# EAGLE schematic Open Flight Controller (EAGLE 9.0.0)

## Sheet 1 of 2
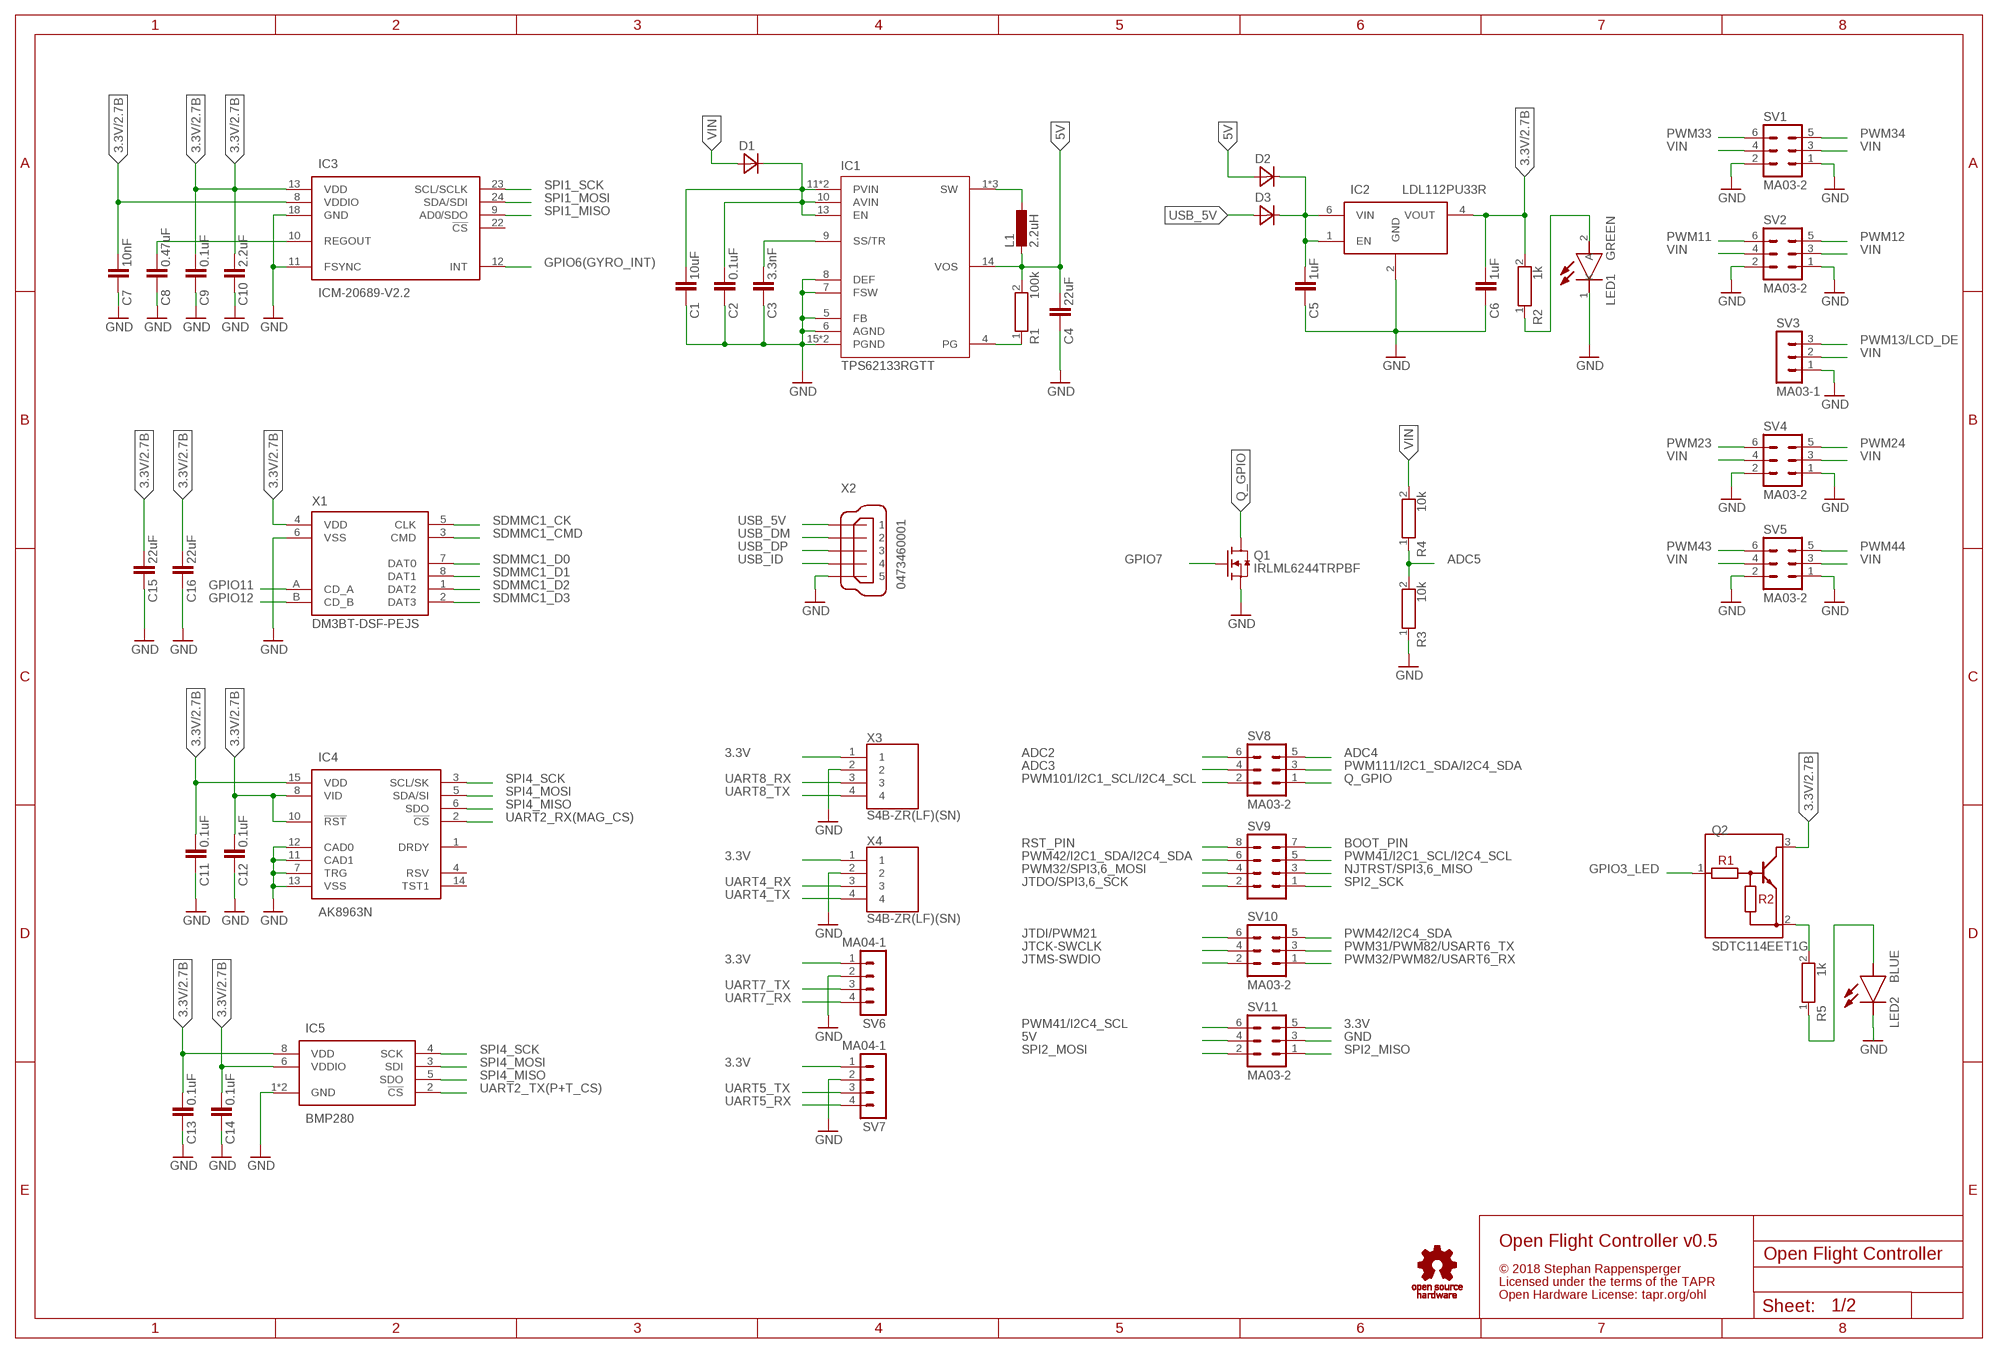
[diagram p0: schematic, sheet 1]

### Parts
C1  10uF  GRM188R61E106MA73D  [CAPC1608X90N]
C2  0.1uF  GRM188R71H104KA93D  [CAPC1608X90N]
C3  3.3nF  GRM188R71H332KA01D  [CAPC1608X90N]
C4  22uF  CL10A226KQ8NRNE  [CAPC1608X100N]
C5  1uF  GRM188R71C105KA12D  [CAPC1608X90N]
C6  1uF  GRM188R71C105KA12D  [CAPC1608X90N]
C7  10nF  GRM1885C1E103JA01D  [CAPC1608X90N]
C8  0.47uF  GRM188R71E474KA12D  [CAPC1608X90N]
C9  0.1uF  GRM188R71H104KA93D  [CAPC1608X90N]
C10  2.2uF  GRM188R71A225KE15D  [CAPC1608X90N]
C11  0.1uF  GRM188R71H104KA93D  [CAPC1608X90N]
C12  0.1uF  GRM188R71H104KA93D  [CAPC1608X90N]
C13  0.1uF  GRM188R71H104KA93D  [CAPC1608X90N]
C14  0.1uF  GRM188R71H104KA93D  [CAPC1608X90N]
C15  22uF  CL10A226KQ8NRNE  [CAPC1608X100N]
C16  22uF  CL10A226KQ8NRNE  [CAPC1608X100N]
D1  RBR3MM40ATR  [PMDU]
D2  RBR3MM40ATR  [PMDU]
D3  RBR3MM40ATR  [PMDU]
IC1  TPS62133RGTT  [RGT16_1P7X1P7]
IC2  LDL112PU33R  [SON50P200X200X80-7N]
IC3  ICM-20689-V2.2  [QFN50P400X400X95-25N]
IC4  AK8963N  [QFN50P300X300X80-17N]
IC5  BMP280  [8-PIN-METAL-LID-LGA]
L1  2.2uH  DFE252012P-2R2M=P2  [INDC2520X120N]
LED1  GREEN  VLMG1300-GS08  [LEDC1608X100N]
LED2  BLUE  VLMB1300-GS08  [LEDC1608X100N]
Q1  IRLML6244TRPBF  [SOT95P237X112-3N]
Q2  SDTC114EET1G  [SOT50P160X90-3N]
R1  100k  CRCW0603100KFKEA  [RESC1608X50N]
R2  1k  CRCW06031K00FKEA  [RESC1608X50N]
R3  10k  CRCW060310K0FKEA  [RESC1608X50N]
R4  10k  CRCW060310K0FKEA  [RESC1608X50N]
R5  1k  CRCW06031K00FKEA  [RESC1608X50N]
SV1  MA03-2  [MA03-2]
SV2  MA03-2  [MA03-2]
SV3  MA03-1  [MA03-1]
SV4  MA03-2  [MA03-2]
SV5  MA03-2  [MA03-2]
SV6  MA04-1  [MA04-1]
SV7  MA04-1  [MA04-1]
SV8  MA03-2  [MA03-2]
SV9  MA04-2  [MA04-2]
SV10  MA03-2  [MA03-2]
SV11  MA03-2  [MA03-2]
X1  DM3BT-DSF-PEJS  [DM3BT-DSF-PEJS]
X2  0473460001  [0473460001]
X3  S4B-ZR(LF)(SN)  [SHDR4W50P0X150_1X4_750X600X370]
X4  S4B-ZR(LF)(SN)  [SHDR4W50P0X150_1X4_750X600X370]

### Nets
3.3V: C6.1 C7.1 C9.1 C10.1 C11.1 C12.1 C13.1 C14.1 C15.1 C16.1 IC2.4(VOUT) IC3.8(VDDIO) IC3.13(VDD) IC4.8(VID) IC4.10(!RST) IC4.15(VDD) IC5.6(VDDIO) IC5.8(VDD) Q2.3(C) R2.2 SV6.1 SV7.1 SV11.5 X1.4(VDD) X3.1 X4.1 ; also sheet 2
5V: C4.1 D2.1(A) IC1.14(VOS) L1.1 R1.2 SV11.4
ADC2: SV8.6 ; also sheet 2
ADC3: SV8.4 ; also sheet 2
ADC4: SV8.5 ; also sheet 2
ADC5: R3.2 R4.1 ; also sheet 2
BOOT_PIN: SV9.7 ; also sheet 2
GND: C1.2 C2.2 C3.2 C4.2 C5.2 C6.2 C7.2 C8.2 C9.2 C10.2 C11.2 C12.2 C13.2 C14.2 C15.2 C16.2 IC1.5(FB) IC1.6(AGND) IC1.7(FSW) IC1.8(DEF) IC1.15(PGND) IC1.16(PGND) IC2.2(GND) IC3.11(FSYNC) IC3.18(GND) IC4.7(TRG) IC4.11(CAD1) IC4.12(CAD0) IC4.13(VSS) IC5.1(GND) IC5.7(GND) LED1.1(K) LED2.1(K) Q1.2(S) R3.1 SV1.1 SV1.2 SV2.1 SV2.2 SV3.1 SV4.1 SV4.2 SV5.1 SV5.2 SV6.2 SV7.2 SV11.3 X1.6(VSS) X2.5 X3.2 X4.2 ; also sheet 2
GPIO3_LED: Q2.1(B) ; also sheet 2
GPIO6(GYRO_INT): IC3.12(INT) ; also sheet 2
GPIO7: Q1.1(G) ; also sheet 2
GPIO11: X1.A(CD_A) ; also sheet 2
GPIO12: X1.B(CD_B) ; also sheet 2
JTCK-SWCLK: SV10.4 ; also sheet 2
JTDI/PWM21: SV10.6 ; also sheet 2
JTDO/SPI3,6_SCK: SV9.2 ; also sheet 2
JTMS-SWDIO: SV10.2 ; also sheet 2
N$1: C1.1 C2.1 D1.2(C) IC1.10(AVIN) IC1.11(PVIN) IC1.12(PVIN) IC1.13(EN)
N$2: IC1.1(SW) IC1.2(SW) IC1.3(SW) L1.2
N$3: C3.1 IC1.9(SS/TR)
N$4: IC1.4(PG) R1.1
N$5: C5.1 D2.2(C) D3.2(C) IC2.1(EN) IC2.6(VIN)
N$6: LED1.2(A) R2.1
N$8: C8.1 IC3.10(REGOUT)
N$15: Q2.2(E) R5.2
N$16: LED2.2(A) R5.1
NJTRST/SPI3,6_MISO: SV9.3 ; also sheet 2
PWM11: SV2.6 ; also sheet 2
PWM12: SV2.5 ; also sheet 2
PWM13/LCD_DE: SV3.3 ; also sheet 2
PWM23: SV4.6 ; also sheet 2
PWM24: SV4.5 ; also sheet 2
PWM31/PWM82/USART6_TX: SV10.3 ; also sheet 2
PWM32/PWM82/USART6_RX: SV10.1 ; also sheet 2
PWM32/SPI3,6_MOSI: SV9.4 ; also sheet 2
PWM33: SV1.6 ; also sheet 2
PWM34: SV1.5 ; also sheet 2
PWM41/I2C1_SCL/I2C4_SCL: SV9.5 ; also sheet 2
PWM41/I2C4_SCL: SV11.6 ; also sheet 2
PWM42/I2C1_SDA/I2C4_SDA: SV9.6 ; also sheet 2
PWM42/I2C4_SDA: SV10.5 ; also sheet 2
PWM43: SV5.6 ; also sheet 2
PWM44: SV5.5 ; also sheet 2
PWM101/I2C1_SCL/I2C4_SCL: SV8.2 ; also sheet 2
PWM111/I2C1_SDA/I2C4_SDA: SV8.3 ; also sheet 2
Q_GPIO: Q1.3(D) SV8.1
RST_PIN: SV9.8 ; also sheet 2
SDMMC1_CK: X1.5(CLK) ; also sheet 2
SDMMC1_CMD: X1.3(CMD) ; also sheet 2
SDMMC1_D0: X1.7(DAT0) ; also sheet 2
SDMMC1_D1: X1.8(DAT1) ; also sheet 2
SDMMC1_D2: X1.1(DAT2) ; also sheet 2
SDMMC1_D3: X1.2(DAT3) ; also sheet 2
SPI1_MISO: IC3.9(AD0/SDO) ; also sheet 2
SPI1_MOSI: IC3.24(SDA/SDI) ; also sheet 2
SPI1_SCK: IC3.23(SCL/SCLK) ; also sheet 2
SPI2_MISO: SV11.1 ; also sheet 2
SPI2_MOSI: SV11.2 ; also sheet 2
SPI2_SCK: SV9.1 ; also sheet 2
SPI4_MISO: IC4.6(SDO) IC5.5(SDO) ; also sheet 2
SPI4_MOSI: IC4.5(SDA/SI) IC5.3(SDI) ; also sheet 2
SPI4_SCK: IC4.3(SCL/SK) IC5.4(SCK) ; also sheet 2
UART2_RX(MAG_CS): IC4.2(!CS) ; also sheet 2
UART2_TX(P+T_CS): IC5.2(!CS) ; also sheet 2
UART4_RX: X4.3 ; also sheet 2
UART4_TX: X4.4 ; also sheet 2
UART5_RX: SV7.4 ; also sheet 2
UART5_TX: SV7.3 ; also sheet 2
UART7_RX: SV6.4 ; also sheet 2
UART7_TX: SV6.3 ; also sheet 2
UART8_RX: X3.3 ; also sheet 2
UART8_TX: X3.4 ; also sheet 2
USB_5V: D3.1(A) X2.1
USB_DM: X2.2 ; also sheet 2
USB_DP: X2.3 ; also sheet 2
USB_ID: X2.4 ; also sheet 2
VIN: D1.1(A) R4.2 SV1.3 SV1.4 SV2.3 SV2.4 SV3.2 SV4.3 SV4.4 SV5.3 SV5.4
Unconnected: IC3.22(!CS) IC4.1(DRDY) IC4.4(RSV) IC4.14(TST1)

### Notes on the sheet
- Open Flight Controller v0.5
- © 2018 Stephan Rappensperger
- Licensed under the terms of the TAPR
- Open Hardware License: tapr.org/ohl

## Sheet 2 of 2
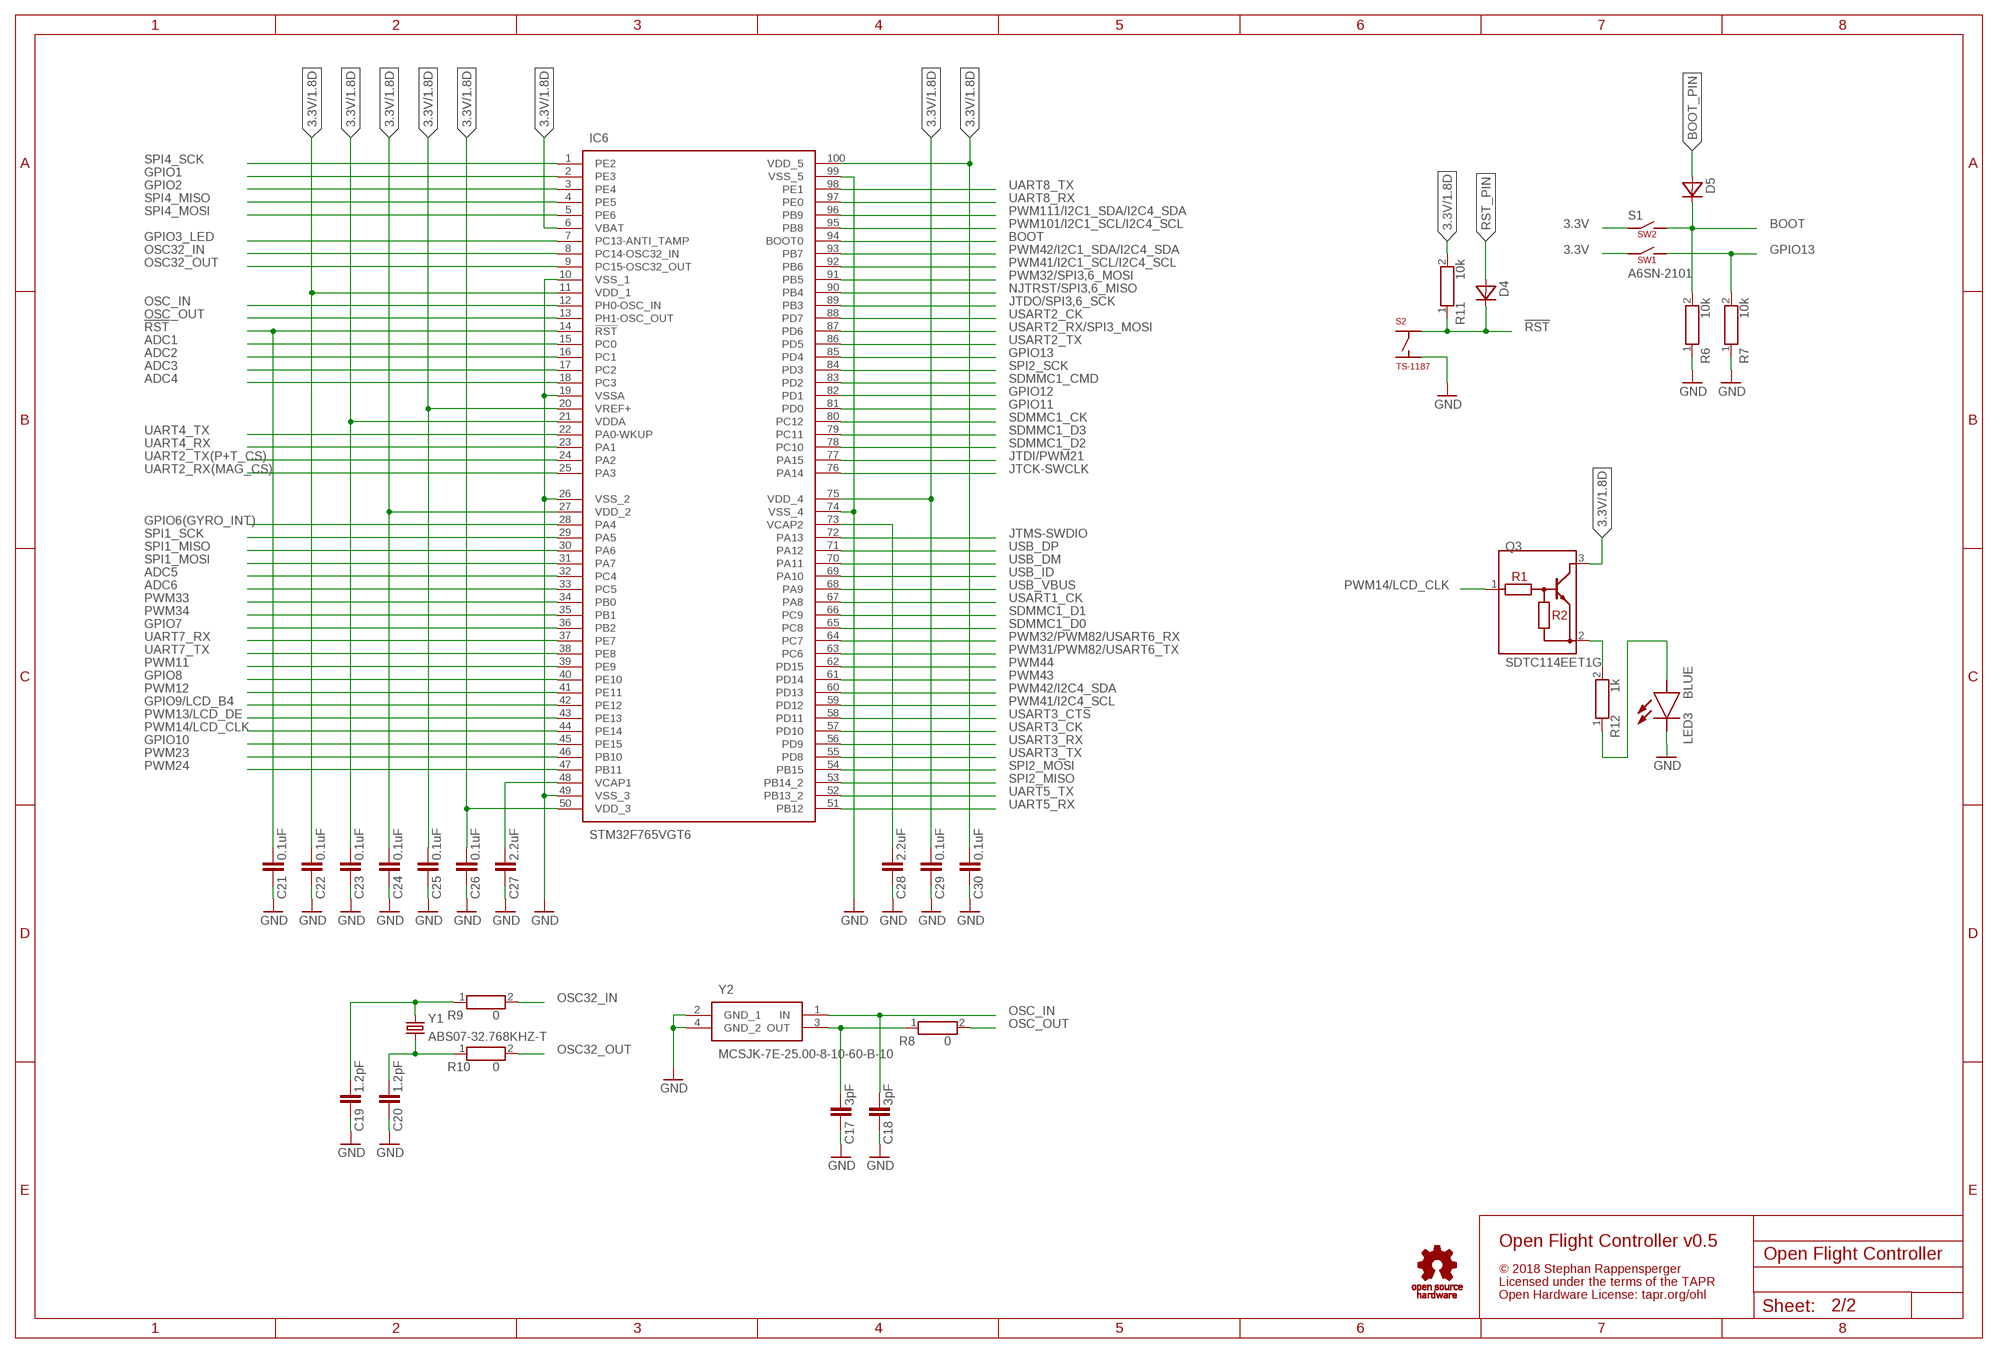
[diagram p1: schematic, sheet 2]

### Parts
C17  3pF  GRM188R71C105KA12D  [CAPC1608X90N]
C18  3pF  GRM188R71C105KA12D  [CAPC1608X90N]
C19  1.2pF  GRM188R71C105KA12D  [CAPC1608X90N]
C20  1.2pF  GRM188R71C105KA12D  [CAPC1608X90N]
C21  0.1uF  GRM188R71H104KA93D  [CAPC1608X90N]
C22  0.1uF  GRM188R71H104KA93D  [CAPC1608X90N]
C23  0.1uF  GRM188R71H104KA93D  [CAPC1608X90N]
C24  0.1uF  GRM188R71H104KA93D  [CAPC1608X90N]
C25  0.1uF  GRM188R71H104KA93D  [CAPC1608X90N]
C26  0.1uF  GRM188R71H104KA93D  [CAPC1608X90N]
C27  2.2uF  GRM188R71A225KE15D  [CAPC1608X90N]
C28  2.2uF  GRM188R71A225KE15D  [CAPC1608X90N]
C29  0.1uF  GRM188R71H104KA93D  [CAPC1608X90N]
C30  0.1uF  GRM188R71H104KA93D  [CAPC1608X90N]
D4  RBR3MM40ATR  [PMDU]
D5  RBR3MM40ATR  [PMDU]
IC6  STM32F765VGT6  [QFP50P1600X1600X160-100N]
LED3  BLUE  VLMB1300-GS08  [LEDC1608X100N]
Q3  SDTC114EET1G  [SOT50P160X90-3N]
R6  10k  CRCW060310K0FKEA  [RESC1608X50N]
R7  10k  CRCW060310K0FKEA  [RESC1608X50N]
R8  0  CRCW060310K0FKEA  [RESC1608X50N]
R9  0  CRCW060310K0FKEA  [RESC1608X50N]
R10  0  CRCW060310K0FKEA  [RESC1608X50N]
R11  10k  CRCW060310K0FKEA  [RESC1608X50N]
R12  1k  CRCW06031K00FKEA  [RESC1608X50N]
S1  A6SN-2101  [SOP254P930X455-4N]
S2  TS-1187  TS-1187TS-1187-H  [TS-1187-3.8]
Y1  ABS07-32.768KHZ-T  [ABS-07]
Y2  MCSJK-7E-25.00-8-10-60-B-10  MCSJK-7E-25.00-10-10-60-B-10  [MCSJK7E2500101060B10]

### Nets
3.3V: C22.1 C23.1 C24.1 C25.1 C26.1 C29.1 C30.1 IC6.6(VBAT) IC6.11(VDD_1) IC6.20(VREF+) IC6.21(VDDA) IC6.27(VDD_2) IC6.50(VDD_3) IC6.75(VDD_4) IC6.100(VDD_5) Q3.3(C) R11.2 S1.1(COM_1) S1.2(COM_2) ; also sheet 1
!RST: C21.1 D4.2(C) IC6.14(!RST) R11.1 S2.P$2
ADC1: IC6.15(PC0)
ADC2: IC6.16(PC1) ; also sheet 1
ADC3: IC6.17(PC2) ; also sheet 1
ADC4: IC6.18(PC3) ; also sheet 1
ADC5: IC6.32(PC4) ; also sheet 1
ADC6: IC6.33(PC5)
BOOT: D5.2(C) IC6.94(BOOT0) R6.2 S1.4(NO_1)
BOOT_PIN: D5.1(A) ; also sheet 1
GND: C17.2 C18.2 C19.2 C20.2 C21.2 C22.2 C23.2 C24.2 C25.2 C26.2 C27.2 C28.2 C29.2 C30.2 IC6.10(VSS_1) IC6.19(VSSA) IC6.26(VSS_2) IC6.49(VSS_3) IC6.74(VSS_4) IC6.99(VSS_5) LED3.1(K) R6.1 R7.1 S2.P$4 Y2.2(GND_1) Y2.4(GND_2) ; also sheet 1
GPIO1: IC6.2(PE3)
GPIO2: IC6.3(PE4)
GPIO3_LED: IC6.7(PC13-ANTI_TAMP) ; also sheet 1
GPIO6(GYRO_INT): IC6.28(PA4) ; also sheet 1
GPIO7: IC6.36(PB2) ; also sheet 1
GPIO8: IC6.40(PE10)
GPIO9/LCD_B4: IC6.42(PE12)
GPIO10: IC6.45(PE15)
GPIO11: IC6.81(PD0) ; also sheet 1
GPIO12: IC6.82(PD1) ; also sheet 1
GPIO13: IC6.85(PD4) R7.2 S1.3(NO_2)
JTCK-SWCLK: IC6.76(PA14) ; also sheet 1
JTDI/PWM21: IC6.77(PA15) ; also sheet 1
JTDO/SPI3,6_SCK: IC6.89(PB3) ; also sheet 1
JTMS-SWDIO: IC6.72(PA13) ; also sheet 1
N$7: C17.1 R8.1 Y2.3(OUT)
N$10: C27.1 IC6.48(VCAP1)
N$11: C28.1 IC6.73(VCAP2)
N$17: Q3.2(E) R12.2
N$18: C20.1 R10.1 Y1.2
N$19: C19.1 R9.1 Y1.1
N$20: LED3.2(A) R12.1
NJTRST/SPI3,6_MISO: IC6.90(PB4) ; also sheet 1
OSC32_IN: IC6.8(PC14-OSC32_IN) R9.2
OSC32_OUT: IC6.9(PC15-OSC32_OUT) R10.2
OSC_IN: C18.1 IC6.12(PH0-OSC_IN) Y2.1(IN)
OSC_OUT: IC6.13(PH1-OSC_OUT) R8.2
PWM11: IC6.39(PE9) ; also sheet 1
PWM12: IC6.41(PE11) ; also sheet 1
PWM13/LCD_DE: IC6.43(PE13) ; also sheet 1
PWM14/LCD_CLK: IC6.44(PE14) Q3.1(B)
PWM23: IC6.46(PB10) ; also sheet 1
PWM24: IC6.47(PB11) ; also sheet 1
PWM31/PWM82/USART6_TX: IC6.63(PC6) ; also sheet 1
PWM32/PWM82/USART6_RX: IC6.64(PC7) ; also sheet 1
PWM32/SPI3,6_MOSI: IC6.91(PB5) ; also sheet 1
PWM33: IC6.34(PB0) ; also sheet 1
PWM34: IC6.35(PB1) ; also sheet 1
PWM41/I2C1_SCL/I2C4_SCL: IC6.92(PB6) ; also sheet 1
PWM41/I2C4_SCL: IC6.59(PD12) ; also sheet 1
PWM42/I2C1_SDA/I2C4_SDA: IC6.93(PB7) ; also sheet 1
PWM42/I2C4_SDA: IC6.60(PD13) ; also sheet 1
PWM43: IC6.61(PD14) ; also sheet 1
PWM44: IC6.62(PD15) ; also sheet 1
PWM101/I2C1_SCL/I2C4_SCL: IC6.95(PB8) ; also sheet 1
PWM111/I2C1_SDA/I2C4_SDA: IC6.96(PB9) ; also sheet 1
RST_PIN: D4.1(A) ; also sheet 1
SDMMC1_CK: IC6.80(PC12) ; also sheet 1
SDMMC1_CMD: IC6.83(PD2) ; also sheet 1
SDMMC1_D0: IC6.65(PC8) ; also sheet 1
SDMMC1_D1: IC6.66(PC9) ; also sheet 1
SDMMC1_D2: IC6.78(PC10) ; also sheet 1
SDMMC1_D3: IC6.79(PC11) ; also sheet 1
SPI1_MISO: IC6.30(PA6) ; also sheet 1
SPI1_MOSI: IC6.31(PA7) ; also sheet 1
SPI1_SCK: IC6.29(PA5) ; also sheet 1
SPI2_MISO: IC6.53(PB14_2) ; also sheet 1
SPI2_MOSI: IC6.54(PB15) ; also sheet 1
SPI2_SCK: IC6.84(PD3) ; also sheet 1
SPI4_MISO: IC6.4(PE5) ; also sheet 1
SPI4_MOSI: IC6.5(PE6) ; also sheet 1
SPI4_SCK: IC6.1(PE2) ; also sheet 1
UART2_RX(MAG_CS): IC6.25(PA3) ; also sheet 1
UART2_TX(P+T_CS): IC6.24(PA2) ; also sheet 1
UART4_RX: IC6.23(PA1) ; also sheet 1
UART4_TX: IC6.22(PA0-WKUP) ; also sheet 1
UART5_RX: IC6.51(PB12) ; also sheet 1
UART5_TX: IC6.52(PB13_2) ; also sheet 1
UART7_RX: IC6.37(PE7) ; also sheet 1
UART7_TX: IC6.38(PE8) ; also sheet 1
UART8_RX: IC6.97(PE0) ; also sheet 1
UART8_TX: IC6.98(PE1) ; also sheet 1
USART1_CK: IC6.67(PA8)
USART2_CK: IC6.88(PD7)
USART2_RX/SPI3_MOSI: IC6.87(PD6)
USART2_TX: IC6.86(PD5)
USART3_CK: IC6.57(PD10)
USART3_CTS: IC6.58(PD11)
USART3_RX: IC6.56(PD9)
USART3_TX: IC6.55(PD8)
USB_DM: IC6.70(PA11) ; also sheet 1
USB_DP: IC6.71(PA12) ; also sheet 1
USB_ID: IC6.69(PA10) ; also sheet 1
USB_VBUS: IC6.68(PA9)
Unconnected: S2.P$1 S2.P$3

### Notes on the sheet
- Open Flight Controller v0.5
- © 2018 Stephan Rappensperger
- Licensed under the terms of the TAPR
- Open Hardware License: tapr.org/ohl

## Library data of the parts
C1 = GRM188R61E106MA73D:GRM188R61E106MA73D: Multilayer Ceramic Capacitors MLCC - SMD/SMT 0603 10uF 25volts X5R 20% Source: Datasheet <http://www.murata.com/~/media/webrenewal/support/library/catalog/products/capacitor/mlcc/c02e.pdf>; ARROW_PART_NUMBER: GRM188R61E106MA73D; ARROW_PRICE/STOCK: https://www.arrow.com/en/products/grm188r61e106ma73d/murata-manufacturing; DESCRIPTION: Multilayer Ceramic Capacitors MLCC - SMD/SMT 0603 10uF 25volts X5R 20%; HEIGHT: 0.9mm; MANUFACTURER_NAME: Murata Electronics; MANUFACTURER_PART_NUMBER: GRM188R61E106MA73D; RS_PART_NUMBER: 8151377P; RS_PRICE/STOCK: http://uk.rs-online.com/web/p/products/8151377P
C2 C9 C11-C14 C21-C26 C29 C30 = GRM188R71H104KA93D:GRM188R71H104KA93D: Ceramic SMT capacitor 100nF 50Vdc Murata 0603 GRM 100nF Ceramic Multilayer Capacitor, 50 V dc, +125?C, X7R Dielectric, ?10% Source: Datasheet <http://psearch.en.murata.com/capacitor/product/GRM188R71H104KA93#.pdf>; ARROW_PART_NUMBER: GRM188R71H104KA93D; ARROW_PRICE/STOCK: https://www.arrow.com/en/products/grm188r71h104ka93d/murata-manufacturing; DESCRIPTION: Ceramic SMT capacitor 100nF 50Vdc Murata 0603 GRM 100nF Ceramic Multilayer Capacitor, 50 V dc, +125?C, X7R Dielectric, ?10%; HEIGHT: 0.9mm; MANUFACTURER_NAME: Murata Electronics; MANUFACTURER_PART_NUMBER: GRM188R71H104KA93D; RS_PART_NUMBER: 6242480P; RS_PRICE/STOCK: http://uk.rs-online.com/web/p/products/6242480P
C3 = GRM188R71H332KA01D:GRM188R71H332KA01D: Murata 0603 GRM 3.3nF Ceramic Multilayer Capacitor, 50 V dc, +125C, X7R Dielectric, 10% Source: Datasheet <http://www.murata.com/~/media/webrenewal/support/library/catalog/products/capacitor/mlcc/c02e.pdf>; ARROW_PART_NUMBER: GRM188R71H332KA01D; ARROW_PRICE/STOCK: http://uk.rs-online.com/web/p/products/2040735; DESCRIPTION: Murata 0603 GRM 3.3nF Ceramic Multilayer Capacitor, 50 V dc, +125C, X7R Dielectric, 10%; HEIGHT: 0.9mm; MANUFACTURER_NAME: Murata Electronics; MANUFACTURER_PART_NUMBER: GRM188R71H332KA01D; RS_PART_NUMBER: 2040735; RS_PRICE/STOCK: http://uk.rs-online.com/web/p/products/2040735
C4 C15 C16 = CL10A226KQ8NRNE:CL10A226KQ8NRNE: CAP CER 22UF 6.3V X5R 0603 Source: Datasheet <http://www.samsungsem.com/kr/support/product-search/mlcc/CL10A226KQ8NRNE.jsp>; ARROW_PART_NUMBER: CL10A226KQ8NRNE; ARROW_PRICE/STOCK: https://www.arrow.com/en/products/cl10a226kq8nrne/samsung-electro-mechanics; DESCRIPTION: CAP CER 22UF 6.3V X5R 0603; HEIGHT: 1mm; MANUFACTURER_NAME: Samsung Electro-Mechanics; MANUFACTURER_PART_NUMBER: CL10A226KQ8NRNE
C5 C6 C17-C20 = GRM188R71C105KA12D:GRM188R71C105KA12D: Ceramic SMT capacitor 1uF 16Vdc Murata 0603 GRM 1uF Ceramic Multilayer Capacitor, 16 V dc, +125degC, X7R Dielectric, /-10% Source: Datasheet <http://psearch.en.murata.com/capacitor/product/GRM188R71C105KA12#.pdf>; ARROW_PART_NUMBER: GRM188R71C105KA12D; ARROW_PRICE/STOCK: http://uk.rs-online.com/web/p/products/1448491; DESCRIPTION: Ceramic SMT capacitor 1uF 16Vdc Murata 0603 GRM 1uF Ceramic Multilayer Capacitor, 16 V dc, +125degC, X7R Dielectric, /-10%; HEIGHT: 0.9mm; MANUFACTURER_NAME: Murata Electronics; MANUFACTURER_PART_NUMBER: GRM188R71C105KA12D; RS_PART_NUMBER: 1448491; RS_PRICE/STOCK: http://uk.rs-online.com/web/p/products/1448491
C7 = GRM1885C1E103JA01D:GRM1885C1E103JA01D: Chip Capacitor value VALUE1 Source: Datasheet; ARROW_PART_NUMBER: GRM1885C1E103JA01D; ARROW_PRICE/STOCK: https://www.arrow.com/en/products/grm1885c1e103ja01d/murata-manufacturing; DESCRIPTION: Chip Capacitor value VALUE1; HEIGHT: 0.9mm; MANUFACTURER_NAME: Murata Electronics; MANUFACTURER_PART_NUMBER: GRM1885C1E103JA01D
C8 = GRM188R71E474KA12D:GRM188R71E474KA12D: Ceramic SMT capacitor 470nF 25Vdc Murata 0603 GRM 470nF Ceramic Multilayer Capacitor, 25 V dc, +125degC, X7R Dielectric, /-10% Source: Datasheet <http://psearch.en.murata.com/capacitor/product/GRM188R71E474KA12#.pdf>; ARROW_PART_NUMBER: GRM188R71E474KA12D; ARROW_PRICE/STOCK: https://www.arrow.com/en/products/grm188r71e474ka12d/murata-manufacturing; DESCRIPTION: Ceramic SMT capacitor 470nF 25Vdc Murata 0603 GRM 470nF Ceramic Multilayer Capacitor, 25 V dc, +125degC, X7R Dielectric, /-10%; HEIGHT: 0.9mm; MANUFACTURER_NAME: Murata Electronics; MANUFACTURER_PART_NUMBER: GRM188R71E474KA12D; RS_PART_NUMBER: 1448494; RS_PRICE/STOCK: http://uk.rs-online.com/web/p/products/1448494
C10 C27 C28 = GRM188R71A225KE15D:GRM188R71A225KE15D: Ceramic SMT capacitor 2.2uF 10Vdc Murata 0603 GRM 2.2??F Ceramic Multilayer Capacitor, 10 V dc, +125??C, X7R Dielectric, ??10% Source: Datasheet <http://psearch.en.murata.com/capacitor/product/GRM188R71A225KE15#.pdf>; ARROW_PART_NUMBER: GRM188R71A225KE15D; ARROW_PRICE/STOCK: http://uk.rs-online.com/web/p/products/7235597P; DESCRIPTION: Ceramic SMT capacitor 2.2uF 10Vdc Murata 0603 GRM 2.2??F Ceramic Multilayer Capacitor, 10 V dc, +125??C, X7R Dielectric, ??10%; HEIGHT: 0.9mm; MANUFACTURER_NAME: Murata Electronics; MANUFACTURER_PART_NUMBER: GRM188R71A225KE15D; RS_PART_NUMBER: 7235597P; RS_PRICE/STOCK: http://uk.rs-online.com/web/p/products/7235597P
D1-D5 = RBR3MM40ATR:RBR3MM40ATR: ROHM RBR3MM40ATR SMT Schottky Diode, 40V 3A, 2-Pin SOD-123FL Source: Datasheet <http://www.rohm.com/web/global/datasheet/RBR3MM40A/rbr3mm40a-e>; ARROW_PART_NUMBER: RBR3MM40ATR; ARROW_PRICE/STOCK: http://uk.rs-online.com/web/p/products/1333268P; DESCRIPTION: ROHM RBR3MM40ATR SMT Schottky Diode, 40V 3A, 2-Pin SOD-123FL; HEIGHT: mm; MANUFACTURER_NAME: ROHM Semiconductor; MANUFACTURER_PART_NUMBER: RBR3MM40ATR; RS_PART_NUMBER: 1333268P; RS_PRICE/STOCK: http://uk.rs-online.com/web/p/products/1333268P
IC1 = TPS62133RGTT:TPS62133RGTT: Buck Schaltregler-IC Positiv Fest 5 V 1 Ausgang 3 A 16-VFQFN mit freiliegendem Pad Source: Datasheet <http://www.ti.com/lit/ds/symlink/tps62132.pdf>; MANUFACTURER_PART_NUMBER: TPS62133RGTT; VENDOR: Texas Instruments
IC2 = LDL112PU33R:LDL112PU33R: LDO Voltage Regulators 1.2 A low quiescent current LDO with reverse current protection Source: Datasheet <https://www.st.com/resource/en/datasheet/ldl112.pdf>; ARROW_PART_NUMBER: LDL112PU33R; ARROW_PRICE/STOCK: https://www.arrow.com/en/products/ldl112pu33r/stmicroelectronics; DESCRIPTION: LDO Voltage Regulators 1.2 A low quiescent current LDO with reverse current protection; HEIGHT: 0.8mm; MANUFACTURER_NAME: STMicroelectronics; MANUFACTURER_PART_NUMBER: LDL112PU33R
IC3 = ICM-20689-v2.2:ICM-20689-V2.2: High Performance 6-Axis MEMS MotionTracking Device Source: Datasheet <http://www.invensense.com/wp-content/uploads/2017/08/ICM-20689-v2.2-002.pdf>; ARROW_PART_NUMBER: ICM-20689-v1.0; DESCRIPTION: High Performance 6-Axis MEMS MotionTracking Device; HEIGHT: 0.95mm; MANUFACTURER_NAME: InvenSense Inc.; MANUFACTURER_PART_NUMBER: ICM-20689-v1.0
IC4 = AK8963N:AK8963N: SENSOR MAGMTR I2C/SPI 16QFN Source: Datasheet <http://www.akm.com/akm/en/file/datasheet/AK8963C.pdf>; ARROW_PART_NUMBER: AK8963N; DESCRIPTION: SENSOR MAGMTR I2C/SPI 16QFN; HEIGHT: 0.8mm; MANUFACTURER_NAME: AKM; MANUFACTURER_PART_NUMBER: AK8963N
IC5 = bmp280:BMP280: Digital Pressure Sensor Source: Datasheet <https://ae-bst.resource.bosch.com/media/_tech/media/datasheets/BST-BMP280-DS001-19.pdf>; ARROW_PART_NUMBER: bmp280; DESCRIPTION: Digital Pressure Sensor; HEIGHT: mm; MANUFACTURER_NAME: Bosch Sensortec; MANUFACTURER_PART_NUMBER: bmp280
IC6 = STM32F765VGT6:STM32F765VGT6: ARM Microcontrollers - MCU 16/32-BITS MICROS Source: Datasheet <http://www.st.com/content/ccc/resource/technical/document/datasheet/group3/c5/37/9c/1d/a6/09/4e/1a/DM00273119/files/DM00273119.pdf/jcr:content/translations/en.DM00273119.pdf>; ARROW_PART_NUMBER: STM32F765VGT6; ARROW_PRICE/STOCK: https://www.arrow.com/en/products/stm32f765vgt6/stmicroelectronics; DESCRIPTION: ARM Microcontrollers - MCU 16/32-BITS MICROS; HEIGHT: 1.6mm; MANUFACTURER_NAME: STMicroelectronics; MANUFACTURER_PART_NUMBER: STM32F765VGT6
L1 = DFE252012P-2R2M=P2:DFE252012P-2R2M=P2: Toko DFE252012P Series Shielded Wire-wound SMD Inductor with a Powered Iron Core, 2.2 H Wire-Wound 3.4A Idc Source: Datasheet <http://docs-europe.electrocomponents.com/webdocs/14f8/0900766b814f8355.pdf>; ARROW_PART_NUMBER: DFE252012P-2R2M=P2; ARROW_PRICE/STOCK: https://www.arrow.com/en/products/dfe252012p-2r2mp2/murata-manufacturing; DESCRIPTION: Toko DFE252012P Series Shielded Wire-wound SMD Inductor with a Powered Iron Core, 2.2 H Wire-Wound 3.4A Idc; HEIGHT: 1.2mm; MANUFACTURER_NAME: Murata Electronics; MANUFACTURER_PART_NUMBER: DFE252012P-2R2M=P2; RS_PART_NUMBER: 1670606; RS_PRICE/STOCK: http://uk.rs-online.com/web/p/products/1670606
LED1 = VLMG1300-GS08:VLMG1300-GS08: VISHAY - VLMG1300-GS08 - LED, YELLOW GREEN, 1.6MM X 0.8MM, 35MCD, 571NM, FULL REEL Source: Datasheet <https://www.vishay.com/docs/82437/vlmo1300.pdf>; ARROW_PART_NUMBER: VLMG1300-GS08; ARROW_PRICE/STOCK: https://www.arrow.com/en/products/vlmg1300-gs08/vishay; DESCRIPTION: VISHAY - VLMG1300-GS08 - LED, YELLOW GREEN, 1.6MM X 0.8MM, 35MCD, 571NM, FULL REEL; HEIGHT: 1mm; MANUFACTURER_NAME: Vishay; MANUFACTURER_PART_NUMBER: VLMG1300-GS08; RS_PART_NUMBER: 1652940; RS_PRICE/STOCK: http://uk.rs-online.com/web/p/products/1652940
LED2 LED3 = VLMB1300-GS08:VLMB1300-GS08: LED Blue 468nm 28-180mcd 0603 ChipLED Vishay VLMB1300-GS08 Blue LED, 475 nm, 1608 (0603), Rectangle Lens SMD Package Source: Datasheet <http://docs-europe.electrocomponents.com/webdocs/1180/0900766b81180479.pdf>; ARROW_PART_NUMBER: VLMB1300-GS08; ARROW_PRICE/STOCK: https://www.arrow.com/en/products/vlmb1300-gs08/vishay; DESCRIPTION: LED Blue 468nm 28-180mcd 0603 ChipLED Vishay VLMB1300-GS08 Blue LED, 475 nm, 1608 (0603), Rectangle Lens SMD Package; HEIGHT: 1mm; MANUFACTURER_NAME: Vishay; MANUFACTURER_PART_NUMBER: VLMB1300-GS08; RS_PART_NUMBER: 7730430P; RS_PRICE/STOCK: http://uk.rs-online.com/web/p/products/7730430P
Q1 = IRLML6244TRPBF:IRLML6244TRPBF: INFINEON - IRLML6244TRPBF - MOSFET, N CH, 20V, 6.3A, SOT-23 Source: Datasheet <http://www.infineon.com/dgdl/irlml6244pbf.pdf?fileId=5546d462533600a4015356686fed261f>; ALLIED_NUMBER: 70411468; ALLIED_PRICE/STOCK: https://www.alliedelec.com/infineon-irlml6244trpbf/70411468/; ARROW_PART_NUMBER: IRLML6244TRPBF; ARROW_PRICE/STOCK: https://www.arrow.com/en/products/irlml6244trpbf/infineon-technologies-ag; DESCRIPTION: INFINEON - IRLML6244TRPBF - MOSFET, N CH, 20V, 6.3A, SOT-23; HEIGHT: 1.12mm; MANUFACTURER_NAME: Infineon; MANUFACTURER_PART_NUMBER: IRLML6244TRPBF; RS_PART_NUMBER: 7377228; RS_PRICE/STOCK: http://uk.rs-online.com/web/p/products/7377228
Q2 Q3 = SDTC114EET1G:SDTC114EET1G: Bipolar Transistors - Pre-Biased SS SC75 BR XSTR NPN 50V Source: Datasheet <http://www.onsemi.com/pub/Collateral/DTC114E-D.PDF>; ARROW_PART_NUMBER: SDTC114EET1G; ARROW_PRICE/STOCK: https://www.arrow.com/en/products/sdtc114eet1g/on-semiconductor; DESCRIPTION: Bipolar Transistors - Pre-Biased SS SC75 BR XSTR NPN 50V; HEIGHT: 0.9mm; MANUFACTURER_NAME: ON Semiconductor; MANUFACTURER_PART_NUMBER: SDTC114EET1G
R1 = CRCW0603100KFKEA:CRCW0603100KFKEA: CRCW0603 Resistor T/R 0.10W,1%,100K Vishay CRCW Series Thick Film Surface Mount Resistor 0603 Case 100kOhm ?1% 0.1W ?100ppm/?C Source: Datasheet <http://www.vishay.com/docs/20035/dcrcwe3.pdf>; ALLIED_NUMBER: 70203523; ALLIED_PRICE/STOCK: http://www.alliedelec.com/vishay-dale-crcw0603100kfkea/70203523/; ARROW_PART_NUMBER: CRCW0603100KFKEA; ARROW_PRICE/STOCK: https://www.arrow.com/en/products/crcw0603100kfkea/vishay; DESCRIPTION: CRCW0603 Resistor T/R 0.10W,1%,100K Vishay CRCW Series Thick Film Surface Mount Resistor 0603 Case 100kOhm ?1% 0.1W ?100ppm/?C; HEIGHT: 0.5mm; MANUFACTURER_NAME: Vishay; MANUFACTURER_PART_NUMBER: CRCW0603100KFKEA; RS_PART_NUMBER: 1694218; RS_PRICE/STOCK: http://uk.rs-online.com/web/p/products/1694218
R2 R5 R12 = CRCW06031K00FKEA:CRCW06031K00FKEA: CRCW0603 Resistor T/R 0.10W,1%,1K Vishay CRCW Series Thick Film Surface Mount Resistor 0603 Case 1k 1% 0.1W 100ppm/C Source: Datasheet <http://www.vishay.com/docs/20035/dcrcwe3.pdf>; ALLIED_NUMBER: 70203133; ALLIED_PRICE/STOCK: https://www.alliedelec.com/vishay-dale-crcw06031k00fkea/70203133/; ARROW_PART_NUMBER: CRCW06031K00FKEA; ARROW_PRICE/STOCK: https://www.arrow.com/en/products/crcw06031k00fkea/vishay; DESCRIPTION: CRCW0603 Resistor T/R 0.10W,1%,1K Vishay CRCW Series Thick Film Surface Mount Resistor 0603 Case 1k 1% 0.1W 100ppm/C; HEIGHT: 0.5mm; MANUFACTURER_NAME: Vishay; MANUFACTURER_PART_NUMBER: CRCW06031K00FKEA; RS_PART_NUMBER: 1694265; RS_PRICE/STOCK: http://uk.rs-online.com/web/p/products/1694265
R3 R4 R6-R11 = CRCW060310K0FKEA:CRCW060310K0FKEA: CRCW0603 Resistor T/R 0.10W,1%,10K Vishay CRCW Series Thick Film Surface Mount Resistor 0603 Case 10k 1% 0.1W 100ppm/C Source: Datasheet <http://www.vishay.com/docs/20035/dcrcwe3.pdf>; ALLIED_NUMBER: 70201153; ALLIED_PRICE/STOCK: https://www.alliedelec.com/vishay-dale-crcw060310k0fkea/70201153/; ARROW_PART_NUMBER: CRCW060310K0FKEA; ARROW_PRICE/STOCK: https://www.arrow.com/en/products/crcw060310k0fkea/vishay; DESCRIPTION: CRCW0603 Resistor T/R 0.10W,1%,10K Vishay CRCW Series Thick Film Surface Mount Resistor 0603 Case 10k 1% 0.1W 100ppm/C; HEIGHT: 0.5mm; MANUFACTURER_NAME: Vishay; MANUFACTURER_PART_NUMBER: CRCW060310K0FKEA; RS_PART_NUMBER: 1694216; RS_PRICE/STOCK: http://uk.rs-online.com/web/p/products/1694216
S1 = A6SN-2101:A6SN-2101: OMRON ELECTRONIC COMPONENTS - A6SN-3101 - SWITCH, DIP, 3POS, SPST, FLAT Source: Datasheet <http://omronfs.omron.com/en_US/ecb/products/pdf/en-a6sn.pdf>
S2 = TS-1187:TS-1187
SV1 SV2 SV4 SV5 SV8 SV10 SV11 = MA03-2:MA03-2
SV3 = MA03-1:MA03-1
SV6 SV7 = MA04-1:MA04-1
SV9 = MA04-2:MA04-2: PIN HEADER; OC_FARNELL: unknown; OC_NEWARK: unknown
X1 = DM3BT-DSF-PEJS:DM3BT-DSF-PEJS
X2 = 0473460001:0473460001: Micro-USB B Receptacle with Flange, Bottom Mount, Surface Mount, Lead-Free Source: Datasheet <http://www.molex.com/pdm_docs/sd/473460001_sd.pdf>; ARROW_PART_NUMBER: 0473460001; ARROW_PRICE/STOCK: https://www.arrow.com/en/products/0473460001/molex; DESCRIPTION: Micro-USB B Receptacle with Flange, Bottom Mount, Surface Mount, Lead-Free; HEIGHT: mm; MANUFACTURER_NAME: Molex; MANUFACTURER_PART_NUMBER: 0473460001
X3 X4 = S4B-ZR(LF)(SN):S4B-ZR(LF)(SN): ZH 1.5MM HEADER SIDE ENTRY 04WAY JST ZH Series, 1.5mm Pitch 4 Way 1 Row Side Entry PCB Header, Solder Termination, 1A Source: Datasheet <http://www.jst-mfg.com/product/pdf/eng/eZH.pdf>; ARROW_PART_NUMBER: S4B-ZR (LF)(SN); ARROW_PRICE/STOCK: http://uk.rs-online.com/web/p/products/1724917; DESCRIPTION: ZH 1.5MM HEADER SIDE ENTRY 04WAY JST ZH Series, 1.5mm Pitch 4 Way 1 Row Side Entry PCB Header, Solder Termination, 1A; HEIGHT: 3.7mm; MANUFACTURER_NAME: JST (JAPAN SOLDERLESS TERMINALS); MANUFACTURER_PART_NUMBER: S4B-ZR (LF)(SN); RS_PART_NUMBER: 1724917; RS_PRICE/STOCK: http://uk.rs-online.com/web/p/products/1724917
Y1 = ABS07-32.768KHZ-T:ABS07-32.768KHZ-T: 32.768kHz SMD LOW PROFILE CRYSTAL Source: Datasheet <http://www.abracon.com/Resonators/ABS07.pdf>; ARROW_PART_NUMBER: ABS07-32.768KHZ-T; ARROW_PRICE/STOCK: https://www.arrow.com/en/products/abs07-32.768khz-t/abracon; DESCRIPTION: 32.768kHz SMD LOW PROFILE CRYSTAL; HEIGHT: mm; MANUFACTURER_NAME: ABRACON; MANUFACTURER_PART_NUMBER: ABS07-32.768KHZ-T; RS_PART_NUMBER: 1712839; RS_PRICE/STOCK: http://uk.rs-online.com/web/p/products/1712839
Y2 = MCSJK-7E-25.00-10-10-60-B-10:MCSJK-7E-25.00-10-10-60-B-10: MULTICOMP - MCSJK-7E-25.00-10-10-60-B-10 - CRYSTAL, 25MHZ, 10PF, 2.5MM X 2MM Source: Datasheet <http://www.farnell.com/datasheets/2608076.pdf>; ARROW_PART_NUMBER: MCSJK-7E-25.00-10-10-60-B-10; DESCRIPTION: MULTICOMP - MCSJK-7E-25.00-10-10-60-B-10 - CRYSTAL, 25MHZ, 10PF, 2.5MM X 2MM; HEIGHT: 0mm; MANUFACTURER_NAME: MULTICOMP; MANUFACTURER_PART_NUMBER: MCSJK-7E-25.00-10-10-60-B-10